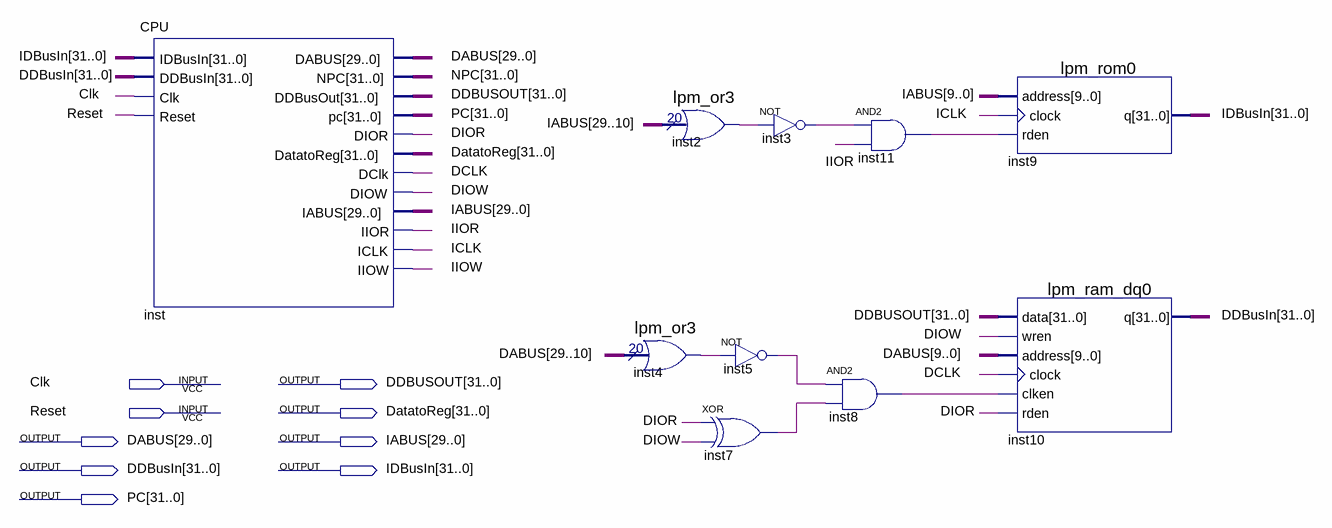
[diagram p0: schematic sheet]
// Quartus schematic COPE.bdf as structural Verilog: 10 symbols, 9 pins
module COPE (
  input  Clk,
  input  Reset,
  output [31:0] DDBUSOUT,
  output [31:0] DatatoReg,
  output [29:0] DABUS,
  output [29:0] IABUS,
  output [31:0] DDBusIn,
  output [31:0] IDBusIn,
  output [31:0] PC
);

  wire DCLK, DIOR, DIOW, ICLK, IIOR, IIOW, inst2_result, inst3_out, inst4_result, inst5_out, inst7_out,
       inst8_out, inst11_out;
  wire [31:0] NPC;

  CPU inst (
    .IDBusIn(IDBusIn), .DDBusIn(DDBusIn), .Clk(Clk), .Reset(Reset), .DABUS(DABUS), .NPC(NPC),
    .DDBusOut(DDBUSOUT), .pc(PC), .DIOR(DIOR), .DatatoReg(DatatoReg), .DClk(DCLK), .DIOW(DIOW),
    .IABUS(IABUS), .IIOR(IIOR), .ICLK(ICLK), .IIOW(IIOW));
  lpm_or3 inst2 (.data(IABUS[29:10]), .result(inst2_result));
  lpm_or3 inst4 (.data(DABUS[29:10]), .result(inst4_result));
  not inst5 (inst5_out, inst4_result);
  xor inst7 (inst7_out, DIOR, DIOW);
  not inst3 (inst3_out, inst2_result);
  and inst11 (inst11_out, inst3_out, IIOR);
  and inst8 (inst8_out, inst5_out, inst7_out);
  lpm_rom0 inst9 (.address(IABUS[9:0]), .clock(ICLK), .rden(inst11_out), .q(IDBusIn));
  lpm_ram_dq0 inst10 (
    .data(DDBUSOUT), .wren(DIOW), .address(DABUS[9:0]), .clock(DCLK), .clken(inst8_out), .rden(DIOR),
    .q(DDBusIn));
endmodule
